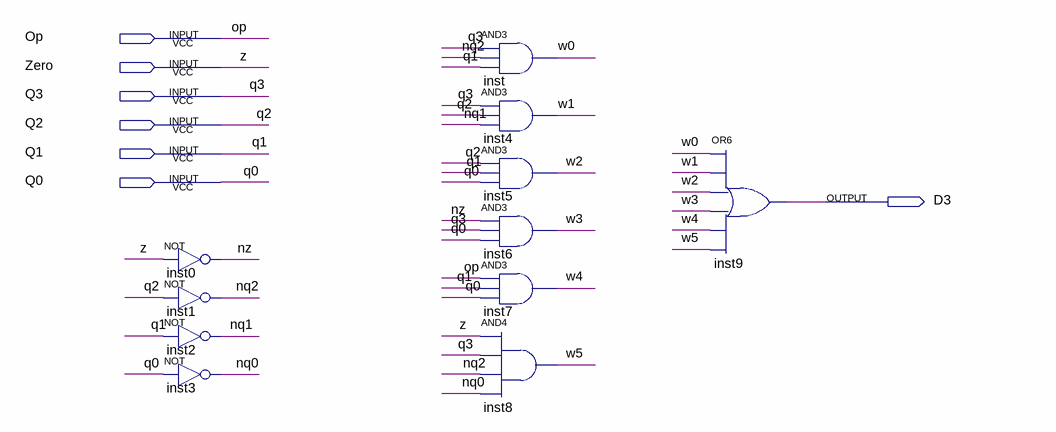
[diagram p0: schematic sheet]
// Quartus schematic D3.bdf as structural Verilog: 11 symbols, 7 pins
module D3 (
  input  Op,
  input  Zero,
  input  Q3,
  input  Q2,
  input  Q1,
  input  Q0,
  output D3
);

  wire nq0, nq1, nq2, nz, w0, w1, w2, w3, w4, w5;

  not inst0 (nz, Zero);
  not inst1 (nq2, Q2);
  not inst2 (nq1, Q1);
  not inst3 (nq0, Q0);
  and inst (w0, Q3, nq2, Q1);
  and inst4 (w1, Q3, Q2, nq1);
  and inst5 (w2, Q2, Q1, Q0);
  and inst6 (w3, nz, Q3, Q0);
  and inst7 (w4, Op, Q1, Q0);
  and inst8 (w5, Zero, Q3, nq2, nq0);
  or inst9 (D3, w0, w1, w2, w3, w4, w5);

  // Other names for the same wires on the sheet: z = Zero
endmodule
